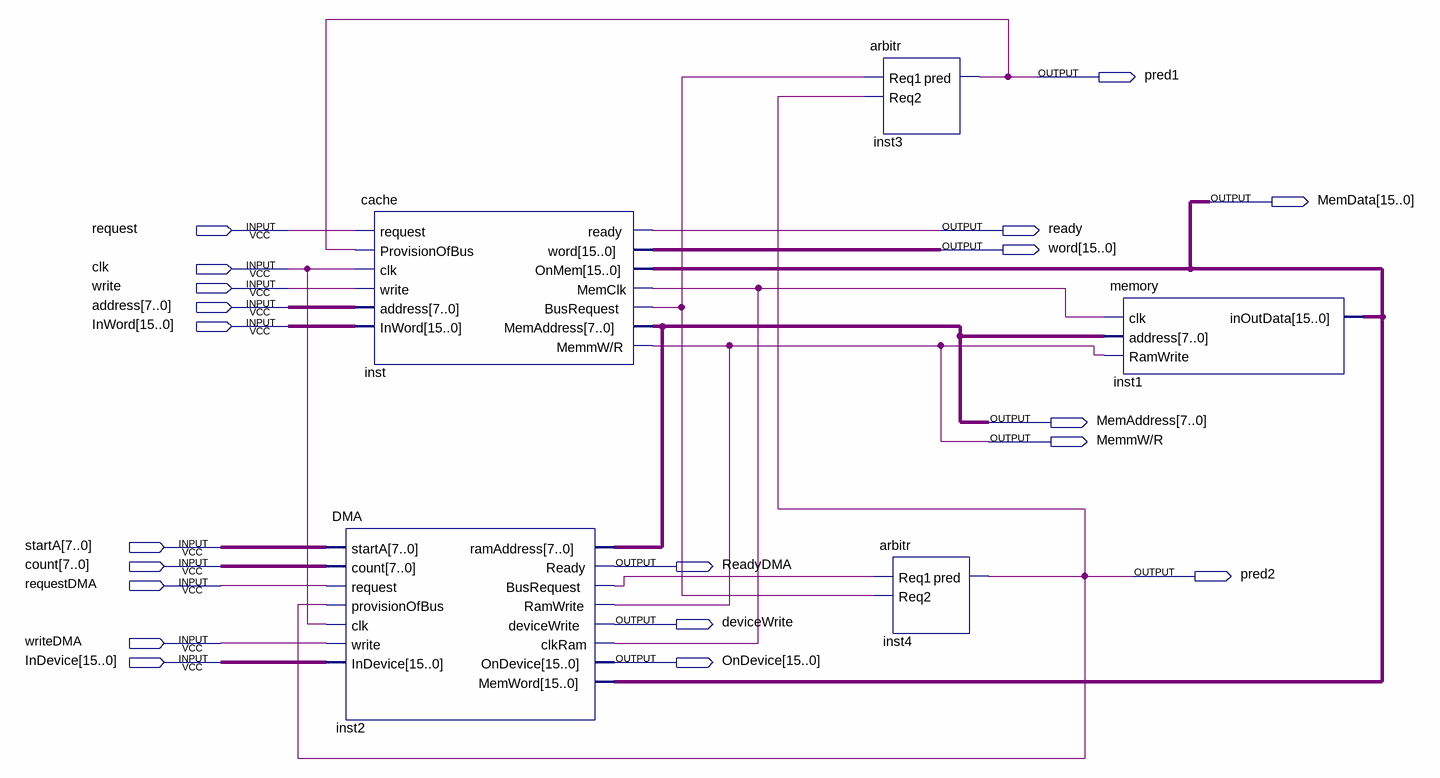
[diagram p0: schematic sheet]
// Quartus schematic some.bdf as structural Verilog: 5 symbols, 20 pins
module some (
  input  request,
  input  clk,
  input  write,
  input  [7:0] address,
  input  [15:0] InWord,
  input  [7:0] startA,
  input  [7:0] count,
  input  requestDMA,
  input  writeDMA,
  input  [15:0] InDevice,
  output pred1,
  output [15:0] MemData,
  output ready,
  output [15:0] word,
  output [7:0] MemAddress,
  output \MemmW/R ,
  output ReadyDMA,
  output pred2,
  output deviceWrite,
  output [15:0] OnDevice
);

  wire inst2_busrequest, inst_busrequest, inst_memclk;

  cache inst (
    .request(request), .ProvisionOfBus(pred1), .clk(clk), .write(write), .address(address), .InWord(InWord),
    .ready(ready), .word(word), .MemClk(inst_memclk), .BusRequest(inst_busrequest), .MemAddress(MemAddress),
    .\MemmW/R (\MemmW/R ), .OnMem(MemData));
  DMA inst2 (
    .startA(startA), .count(count), .request(requestDMA), .provisionOfBus(pred2), .clk(clk),
    .write(writeDMA), .InDevice(InDevice), .ramAddress(MemAddress), .Ready(ReadyDMA),
    .BusRequest(inst2_busrequest), .RamWrite(\MemmW/R ), .deviceWrite(deviceWrite), .clkRam(inst_memclk),
    .OnDevice(OnDevice), .MemWord(MemData));
  arbitr inst3 (.Req1(inst_busrequest), .Req2(pred2), .pred(pred1));
  arbitr inst4 (.Req1(inst2_busrequest), .Req2(inst_busrequest), .pred(pred2));
  memory inst1 (.clk(inst_memclk), .address(MemAddress), .RamWrite(\MemmW/R ), .inOutData(MemData));
endmodule
